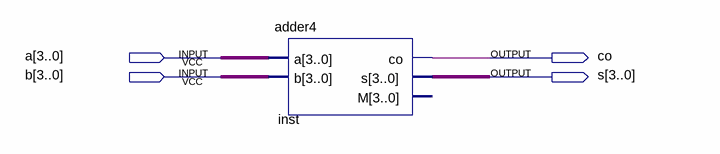
[diagram p0: schematic sheet]
// Quartus schematic shiyan_4.bdf as structural Verilog: 1 symbols, 4 pins
module shiyan_4 (
  input  [3:0] a,
  input  [3:0] b,
  output co,
  output [3:0] s
);

  adder4 inst (.a(a), .b(b), .co(co), .s(s));  // open: M
endmodule
